# Altium schematic sheet Control.SchDoc
size A3; DocumentNumber: 3; SheetNumber: 1; SheetTotal: 5
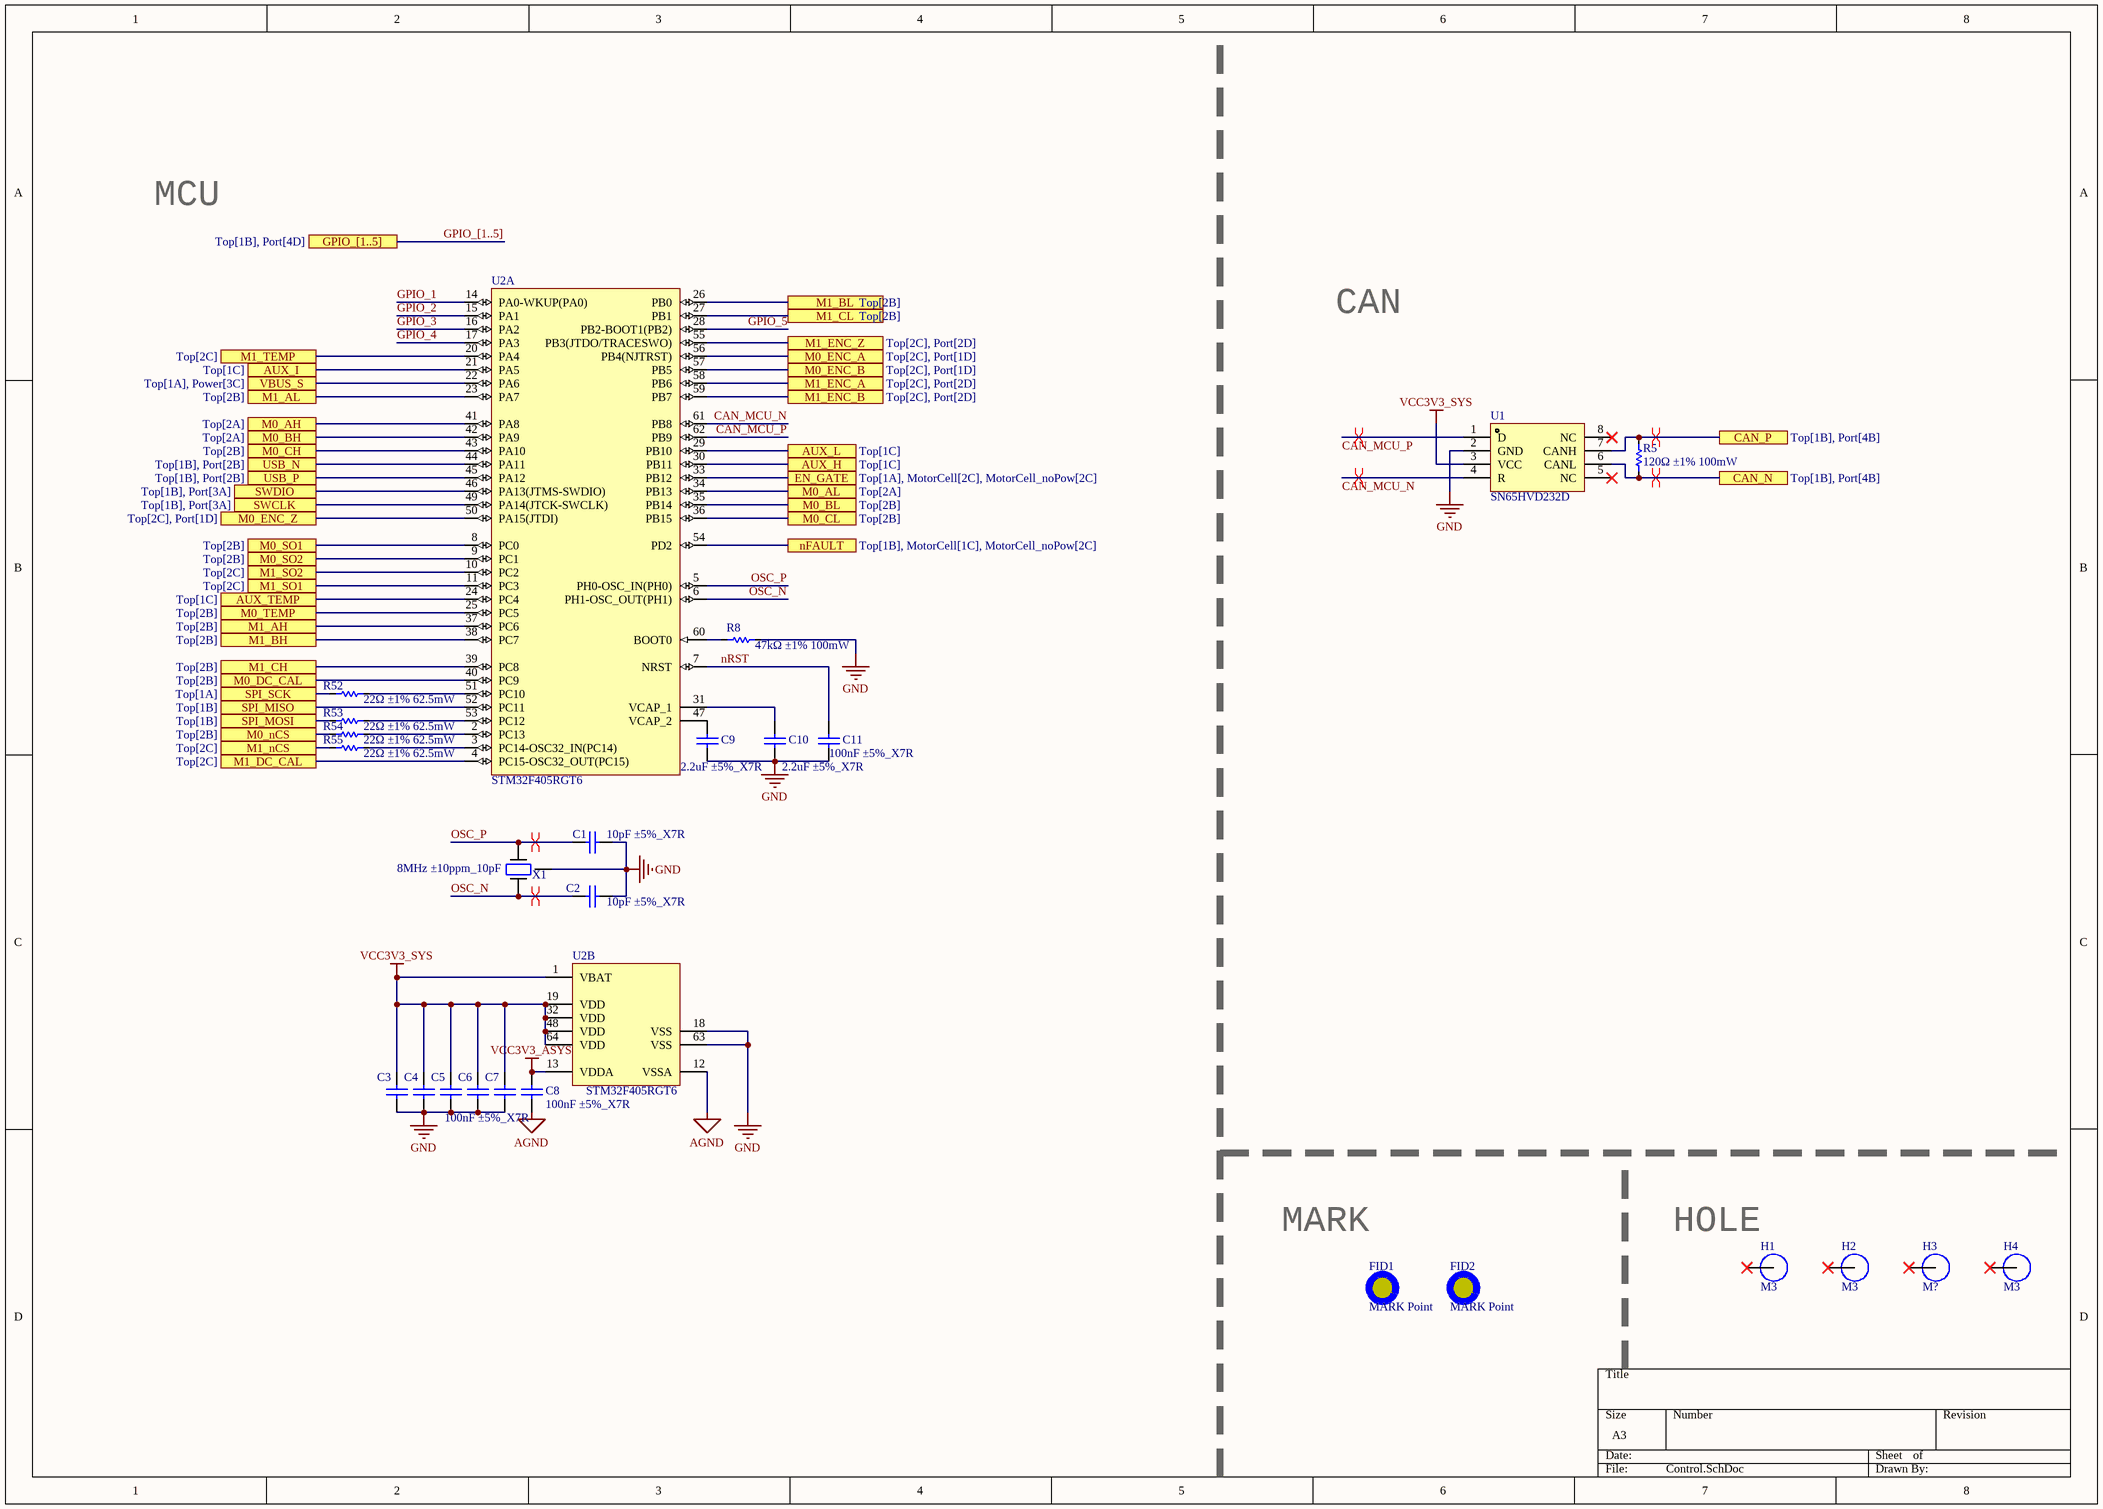
[diagram p0: Control.SchDoc]

## Parts
C1  10pF ±5%_X7R  [C0402]
C2  10pF ±5%_X7R  [C0402]
C3  100nF ±5%_X7R  [C0402]  (value not drawn)
C4  100nF ±5%_X7R  [C0402]
C5  F ±5%_X7R  [C0402]  (value not drawn)
C6  F ±5%_X7R  [C0402]  (value not drawn)
C7  F ±5%_X7R  [C0402]  (value not drawn)
C8  100nF ±5%_X7R  [C0402]
C9  2.2uF ±5%_X7R  [C0603]
C10  2.2uF ±5%_X7R  [C0603]
C11  100nF ±5%_X7R  [C0402]
FID1  MARK Point  [FIDUCIAL]
FID2  MARK Point  [FIDUCIAL]
H1  M3  [M3_NPTH]
H2  M3  [M3_NPTH]
H3  M?  [M3_NPTH]
H4  M3  [M3_NPTH]
R5  120Ω ±1% 100mW  [R0603]
R8  47kΩ ±1% 100mW  [R0402]
R52  22Ω ±1% 62.5mW  [R0402]
R53  22Ω ±1% 62.5mW  [R0402]
R54  22Ω ±1% 62.5mW  [R0402]
R55  22Ω ±1% 62.5mW  [R0402]
U1  SN65HVD232D  [SOIC127P600X175-8N]
U2  STM32F405RGT6  [STM-LQFP64_N]  (parts A,B of 2)
X1  8MHz ±10ppm_10pF  [CRYSTAL_3225]

## Ports
AUX_H (see Top[1C]), AUX_I (see Top[1C]), AUX_L (see Top[1C]), AUX_TEMP (see Top[1C]), CAN_N (see Top[1B], Port[4B]), CAN_P (see Top[1B], Port[4B]), EN_GATE (see Top[1A], MotorCell[2C], MotorCell_noPow[2C]), GPIO_[1..5] (see Top[1B], Port[4D]), M0_AH (see Top[2A]), M0_AL (see Top[2A]), M0_BH (see Top[2A]), M0_BL (see Top[2B]), M0_CH (see Top[2B]), M0_CL (see Top[2B]), M0_DC_CAL (see Top[2B]), M0_ENC_A (see Top[2C], Port[1D]), M0_ENC_B (see Top[2C], Port[1D]), M0_ENC_Z (see Top[2C], Port[1D]), M0_nCS (see Top[2B]), M0_SO1 (see Top[2B]), M0_SO2 (see Top[2B]), M0_TEMP (see Top[2B]), M1_AH (see Top[2B]), M1_AL (see Top[2B]), M1_BH (see Top[2B]), M1_BL (see Top[2B]), M1_CH (see Top[2B]), M1_CL (see Top[2B]), M1_DC_CAL (see Top[2C]), M1_ENC_A (see Top[2C], Port[2D]), M1_ENC_B (see Top[2C], Port[2D]), M1_ENC_Z (see Top[2C], Port[2D]), M1_nCS (see Top[2C]), M1_SO1 (see Top[2C]), M1_SO2 (see Top[2C]), M1_TEMP (see Top[2C]), nFAULT (see Top[1B], MotorCell[1C], MotorCell_noPow[2C]), SPI_MISO (see Top[1B]), SPI_MOSI (see Top[1B]), SPI_SCK (see Top[1A]), SWCLK (see Top[1B], Port[3A]), SWDIO (see Top[1B], Port[3A]), USB_N (see Top[1B], Port[2B]), USB_P (see Top[1B], Port[2B]), VBUS_S (see Top[1A], Power[3C])

## Nets
AGND: C8.1 U2.12(VSSA)
GND: C1.2 C2.2 C3.1 C4.1 C5.1 C6.1 C7.1 C9.1 C10.1 C11.1 R8.2 U1.2(GND) U2.18(VSS) U2.63(VSS) X1.G
VCC3V3_ASYS: C8.2 U2.13(VDDA)
VCC3V3_SYS: C3.2 C4.2 C5.2 C6.2 C7.2 U1.3(VCC) U2.1(VBAT) U2.19(VDD) U2.32(VDD) U2.48(VDD) U2.64(VDD)
AUX_H: U2.30(PB11) ; port AUX_H
AUX_I: U2.21(PA5) ; port AUX_I
AUX_L: U2.29(PB10) ; port AUX_L
AUX_TEMP: U2.24(PC4) ; port AUX_TEMP
CAN_MCU_N: U1.4(R) U2.61(PB8)
CAN_MCU_P: U1.1(D) U2.62(PB9)
CAN_N: R5.1 U1.6(CANL) ; port CAN_N
CAN_P: R5.2 U1.7(CANH) ; port CAN_P
EN_GATE: U2.33(PB12) ; port EN_GATE
GPIO_1: U2.14(PA0-WKUP(PA0))
GPIO_2: U2.15(PA1)
GPIO_3: U2.16(PA2)
GPIO_4: U2.17(PA3)
GPIO_5: U2.28(PB2-BOOT1(PB2))
M0_AH: U2.41(PA8) ; port M0_AH
M0_AL: U2.34(PB13) ; port M0_AL
M0_BH: U2.42(PA9) ; port M0_BH
M0_BL: U2.35(PB14) ; port M0_BL
M0_CH: U2.43(PA10) ; port M0_CH
M0_CL: U2.36(PB15) ; port M0_CL
M0_DC_CAL: U2.40(PC9) ; port M0_DC_CAL
M0_ENC_A: U2.56(PB4(NJTRST)) ; port M0_ENC_A
M0_ENC_B: U2.57(PB5) ; port M0_ENC_B
M0_ENC_Z: U2.50(PA15(JTDI)) ; port M0_ENC_Z
M0_nCS: R54.1 ; port M0_nCS
M0_SO1: U2.8(PC0) ; port M0_SO1
M0_SO2: U2.9(PC1) ; port M0_SO2
M0_TEMP: U2.25(PC5) ; port M0_TEMP
M1_AH: U2.37(PC6) ; port M1_AH
M1_AL: U2.23(PA7) ; port M1_AL
M1_BH: U2.38(PC7) ; port M1_BH
M1_BL: U2.26(PB0) ; port M1_BL
M1_CH: U2.39(PC8) ; port M1_CH
M1_CL: U2.27(PB1) ; port M1_CL
M1_DC_CAL: U2.4(PC15-OSC32_OUT(PC15)) ; port M1_DC_CAL
M1_ENC_A: U2.58(PB6) ; port M1_ENC_A
M1_ENC_B: U2.59(PB7) ; port M1_ENC_B
M1_ENC_Z: U2.55(PB3(JTDO/TRACESWO)) ; port M1_ENC_Z
M1_nCS: R55.1 ; port M1_nCS
M1_SO1: U2.11(PC3) ; port M1_SO1
M1_SO2: U2.10(PC2) ; port M1_SO2
M1_TEMP: U2.20(PA4) ; port M1_TEMP
nFAULT: U2.54(PD2) ; port nFAULT
nRST: C11.2 U2.7(NRST)
OSC_N: C2.1 U2.6(PH1-OSC_OUT(PH1)) X1.1
OSC_P: C1.1 U2.5(PH0-OSC_IN(PH0)) X1.3
SPI_MISO: U2.52(PC11) ; port SPI_MISO
SPI_MOSI: R53.1 ; port SPI_MOSI
SPI_SCK: R52.1 ; port SPI_SCK
SWCLK: U2.49(PA14(JTCK-SWCLK)) ; port SWCLK
SWDIO: U2.46(PA13(JTMS-SWDIO)) ; port SWDIO
USB_N: U2.44(PA11) ; port USB_N
USB_P: U2.45(PA12) ; port USB_P
VBUS_S: U2.22(PA6) ; port VBUS_S
NetC9_2: C9.2 U2.47(VCAP_2)
NetC10_2: C10.2 U2.31(VCAP_1)
NetR8_1: R8.1 U2.60(BOOT0)
NetR52_2: R52.2 U2.51(PC10)
NetR53_2: R53.2 U2.53(PC12)
NetR54_2: R54.2 U2.2(PC13)
NetR55_2: R55.2 U2.3(PC14-OSC32_IN(PC14))

Not connected (* = marked no-connect by the designer): H1 1*; H2 1*; H3 1*; H4 1*; U1 5(NC)* 8(NC)*

## Buses and harness runs
bus GPIO_[1..5] = port GPIO_[1..5]

## Layout directives
differential pair: CAN_MCU_N, CAN_MCU_P, CAN_N, CAN_P, OSC_N, OSC_P

## Notes on the sheet
- MCU
- CAN
- MARK
- (near H1) HOLE

## Library data of the parts
C1-C11 = Cap: Capacitor; Published: 8-Jun-2000; LatestRevisionDate: 17-Jul-2002; LatestRevisionNote: Re-released for DXP Platform.; PackageReference: RAD-0.3; Publisher: Altium Limited; PackageDescription: Radial Cap, Thru-Hole; 2 Leads; 0.3 in Pin Spacing
FID1 FID2 = FIDUCIAL: 1mm Fiducial with 2mm soldermask, 3mm keepout
H1-H4 = NPTH: Hole without copper
R5 R8 R52-R55 = Res: Resistor; Published: 8-Jun-2000; LatestRevisionDate: 17-Jul-2002; LatestRevisionNote: Re-released for DXP Platform.; PackageReference: AXIAL-0.3; Publisher: Altium Limited; PackageDescription: Axial Device, Thru-Hole; 2 Leads; 0.3 in Pin Spacing
U1 = SN65HVD232D: Manufacturer: Texas Instruments; Protocol: CAN; Number of Drivers/Receivers: 1/1; Duplex: Half; Data Rate: 1Mbps; Voltage - Supply: 3 V ~ 3.6 V; Supplier 1: Digi-Key; Supplier Part Number 1: 296-26344-2-ND; RoHS: RoHS Compliant; Category: Integrated Circuits (ICs); Stock: 5000; Pricing 1: 2500=0.84375 (USD); Packaging: Tape & Reel (TR); Part Status: Active; Type: Transceiver; Operating Temperature: -40°C ~ 85°C; Mounting Type: Surface Mount; Package / Case: 8-SOIC (0.154", 3.90mm Width); Supplier Device Package: 8-SOIC; ComponentLink1URL: http://www.ti.com/lit/ds/symlink/sn65hvd230.pdf; ComponentLink1Description: http://www.ti.com/lit/ds/symlink/sn65hvd230.pdf; Supplier 2: Digi-Key; Supplier Part Number 2: 296-26344-1-ND; Pricing 2: 1=2.05, 10=1.842, 100=1.4809, 500=1.21668, 1000=1.00811 (USD)
U2 = STM32F405RGT6: ARM Cortex-M4 32-bit MCU+FPU, 210 DMIPS, 1024 kB Flash, 192 kB Internal RAM, 51 I/Os, 64-pin LQFP, -40 to 85 degC, Tray; Manufacturer: STMicroelectronics; D/A Converter: 2x12-bit; FLASH Size (Prog) (kB): 1024; I/Os (High Current): 51; Internal RAM Size (kB): 192; Operating Frequency(F) (Processor speed) (MHz): 168; Supply Voltage(Vcc) max (V): 3.6; Supply Voltage(Vcc) min (V): 1.8; DatasheetVersion: Rev. 4; PackageVersion: Rev. 4, 06/2013; PackageReference: LQFP64; PackageDescription: 64-Pin Low Profile Quad Flat Package, 10 x 10 mm Body, 0.5 mm Pitch; Supplier 1: Digi-Key; Supplier Part Number 1: 497-11767-ND; Supplier 2: Farnell; Supplier Part Number 2: 2064363; Supplier 3: Newark; Supplier Part Number 3: 73T2329; Supplier 4: Mouser; Supplier Part Number 4: 511-STM32F405RGT6; Core: ARM Cortex-M4; Packing: Tray; Mounting Technology: Surface Mount; PartNumber: STM32F405RGT6; ComponentLink1Description: Manufacturer URL; ComponentLink1URL: http://www.st.com/web/en/home.html; ComponentLink2Description: Datasheet; ComponentLink2URL: http://www.st.com/st-web-ui/static/active/en/resource/technical/document/datasheet/DM00037051.pdf; ComponentLink3Description: Package Specification; ComponentLink3URL: http://www.st.com/st-web-ui/static/active/en/resource/technical/document/datasheet/DM00037051.pdf
X1 = CRYSTAL: Crystal 8MHz ±10ppm 10pF 200 Ohm -10°C ~ 60°C Surface Mount 4-SMD, No Lead (DFN, LCC); Manufacturer: Abracon LLC; Manufacturer Part Number: ABM3B-8.000MHZ-10-1-U-T; Operating Mode: Fundamental; Supplier 1: Digi-Key; Supplier Part Number 1: 535-9721-1-ND; RoHS: RoHS Compliant; Category: Crystals, Oscillators, Resonators; Stock: 35437; Pricing 1: 1=0.69, 10=0.578, 50=0.5198, 100=0.462, 500=0.4389 (USD); Packaging: Cut Tape (CT); Part Status: Active; Type: MHz Crystal; Frequency Stability: ±10ppm; Frequency Tolerance: ±10ppm; Load Capacitance: 10pF; Operating Temperature: -10°C ~ 60°C; Ratings: -; Mounting Type: Surface Mount; Package / Case: 4-SMD, No Lead; Size / Dimension: 0.197" L x 0.126" W (5.00mm x 3.20mm); Height - Seated (Max): 0.043" (1.10mm); ComponentLink1URL: http://www.abracon.com/Resonators/abm3b.pdf; ComponentLink1Description: http://www.abracon.com/Resonators/abm3b.pdf; Supplier 2: Digi-Key; Supplier Part Number 2: 535-9721-2-ND; Pricing 2: 1000=0.336, 3000=0.315, 5000=0.3045, 10000=0.294 (USD)